# EAGLE design sbr (EAGLE 9.5.2)
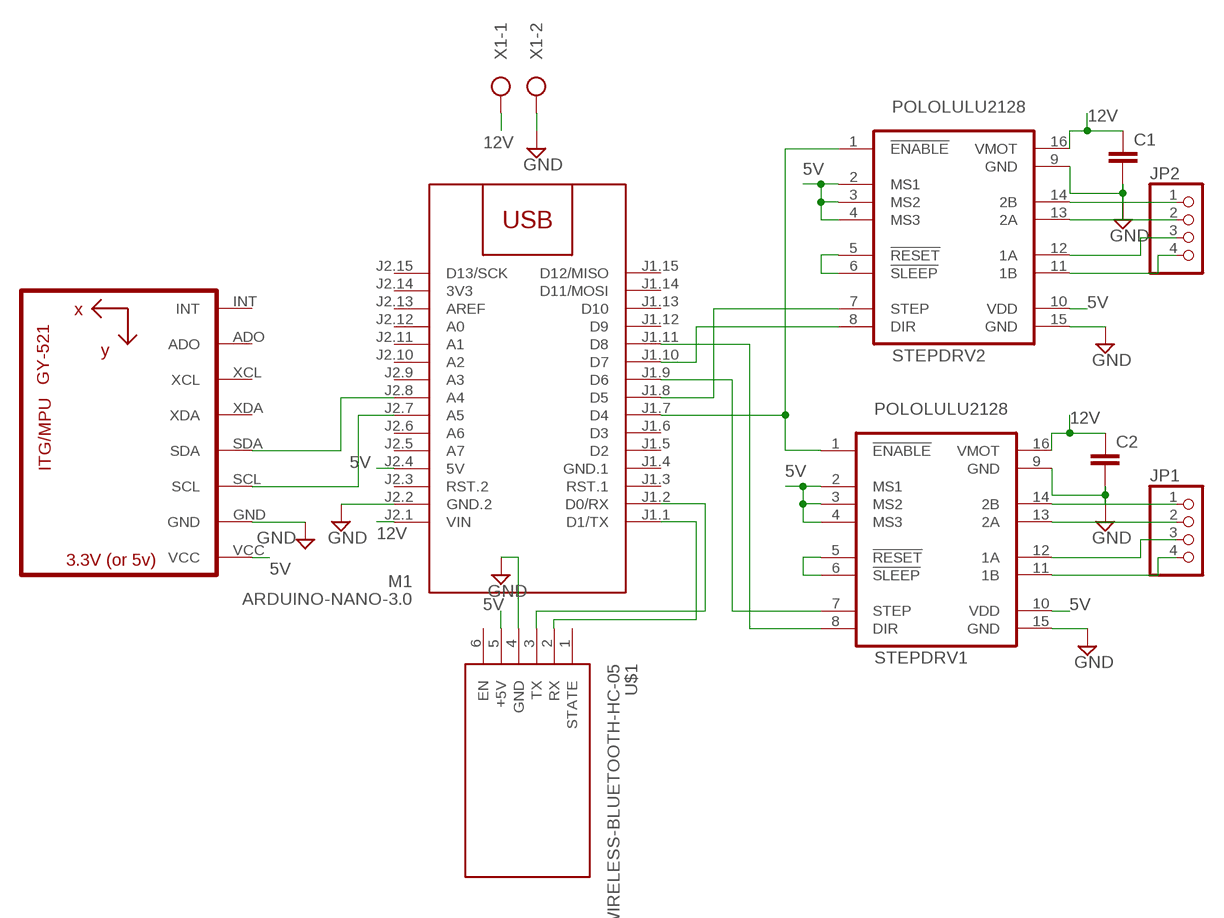
[diagram p0: schematic, sheet 1]

## Parts
C1  C-EU025-024X044  [C025-024X044]
C2  C-EU025-024X044  [C025-024X044]
JP1  PINHD-1X4  [1X04]
JP2  PINHD-1X4  [1X04]
M1  ARDUINO-NANO-3.0  [ARDUINO-NANO-3.0]
STEPDRV1  POLOLULU2128  [POLOLULU2128]
STEPDRV2  POLOLULU2128  [POLOLULU2128]
U1  GY-521MPU6050  [GY-521]
U$1  WIRELESS-BLUETOOTH-HC-05  [WIRELESS-BLUETOOTH-HC-05]
X1  W237-102  [W237-102]

## Nets
5V: M1.J2.4(5V) STEPDRV1.2(MS1) STEPDRV1.3(MS2) STEPDRV1.4(MS3) STEPDRV1.10(VDD) STEPDRV2.2(MS1) STEPDRV2.3(MS2) STEPDRV2.4(MS3) STEPDRV2.10(VDD) U1.VCC U$1.5(+5V)
12V: C1.1 C2.1 M1.J2.1(VIN) STEPDRV1.16(VMOT) STEPDRV2.16(VMOT) X1.1
GND: C1.2 C2.2 M1.J2.2(GND.2) STEPDRV1.9(GND) STEPDRV1.15(GND) STEPDRV2.9(GND) STEPDRV2.15(GND) U1.GND U$1.4(GND) X1.2
N$1: JP2.1 STEPDRV2.14(2B)
N$2: M1.J1.8(D5) STEPDRV2.7(STEP)
N$3: M1.J1.9(D6) STEPDRV1.7(STEP)
N$4: JP1.1 STEPDRV1.14(2B)
N$5: JP1.2 STEPDRV1.13(2A)
N$6: JP1.3 STEPDRV1.12(1A)
N$7: JP1.4 STEPDRV1.11(1B)
N$8: JP2.2 STEPDRV2.13(2A)
N$9: JP2.3 STEPDRV2.12(1A)
N$10: JP2.4 STEPDRV2.11(1B)
N$11: STEPDRV2.5(!RESET) STEPDRV2.6(!SLEEP)
N$12: STEPDRV1.5(!RESET) STEPDRV1.6(!SLEEP)
N$13: M1.J1.7(D4) STEPDRV1.1(!ENABLE) STEPDRV2.1(!ENABLE)
N$14: M1.J1.1(D1/TX) U$1.2(RX)
N$15: M1.J1.2(D0/RX) U$1.3(TX)
N$16: M1.J2.8(A4) U1.SDA
N$17: M1.J2.7(A5) U1.SCL
N$18: M1.J1.10(D7) STEPDRV2.8(DIR)
N$19: M1.J1.11(D8) STEPDRV1.8(DIR)
Unconnected: M1.J1.3(RST.1) M1.J1.5(D2) M1.J1.6(D3) M1.J1.12(D9) M1.J1.13(D10) M1.J1.14(D11/MOSI) M1.J1.15(D12/MISO) M1.J2.3(RST.2) M1.J2.5(A7) M1.J2.6(A6) M1.J2.9(A3) M1.J2.10(A2) M1.J2.11(A1) M1.J2.12(A0) M1.J2.13(AREF) M1.J2.15(D13/SCK) U1.ADO U1.INT U1.XCL U1.XDA U$1.1(STATE) U$1.6(EN)

## Power pins joined to a net without a drawn wire
3V3: M1.J2.14(3V3)
GND.1: M1.J1.4(GND.1)

## Library data of the parts
C1 C2 = rcl:C-EU: CAPACITOR, European symbol; SPICEPREFIX: C
JP1 JP2 = pinhead:PINHD-1X4: PIN HEADER
M1 = diy-modules:ARDUINO-NANO-3.0: Arduino Nano 3.0 and compatible devices More details available here: https://www.arduino.cc/en/Main/ArduinoBoardNano Click here to find device on ebay.com <http://www.ebay.com/sch/arduino+nano>
STEPDRV1 STEPDRV2 = stepper_drivers_etc:POLOLULU2128
U1 = gy-521:GY-521
U$1 = diy-modules:WIRELESS-BLUETOOTH-HC-05: Bluetooth Transceiver Module based on HC-05 board Tutorial is available here: https://arduino-info.wikispaces.com/BlueTooth-HC05-HC06-Modules-How-To Click here to find device on ebay.com <http://www.ebay.com/sch/hc-05+module+rs232>
X1 = con-wago-500:W237-102: WAGO SCREW CLAMP; MPN: 237-102; OC_FARNELL: unknown; OC_NEWARK: 70K9898

## Board
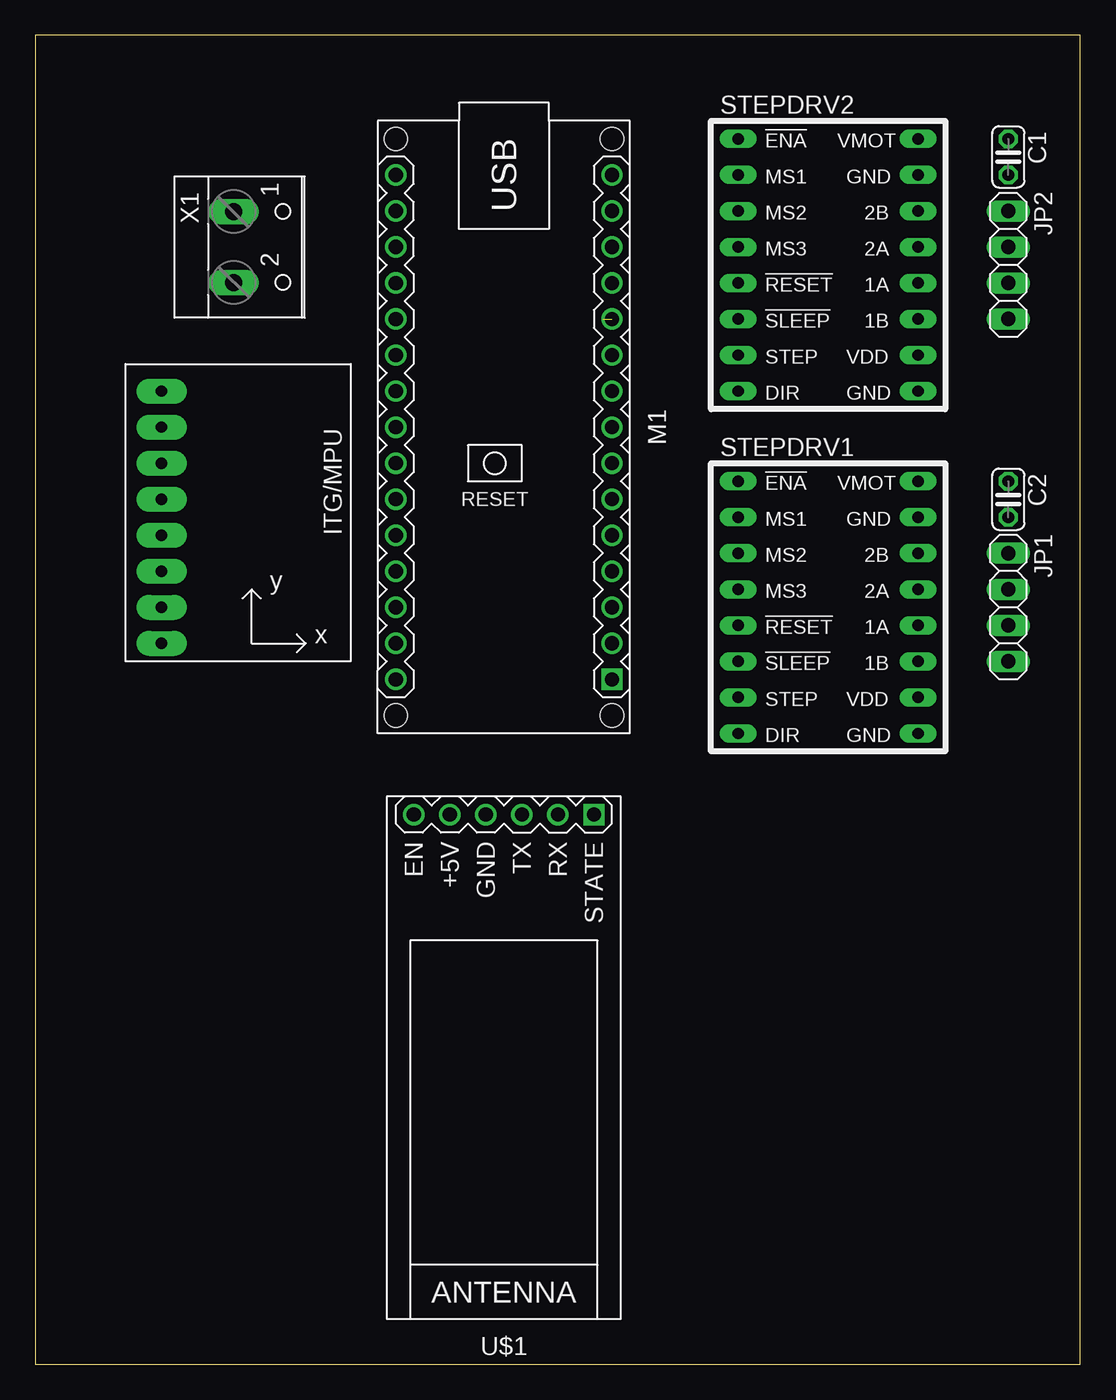
[diagram p1: board, top side]
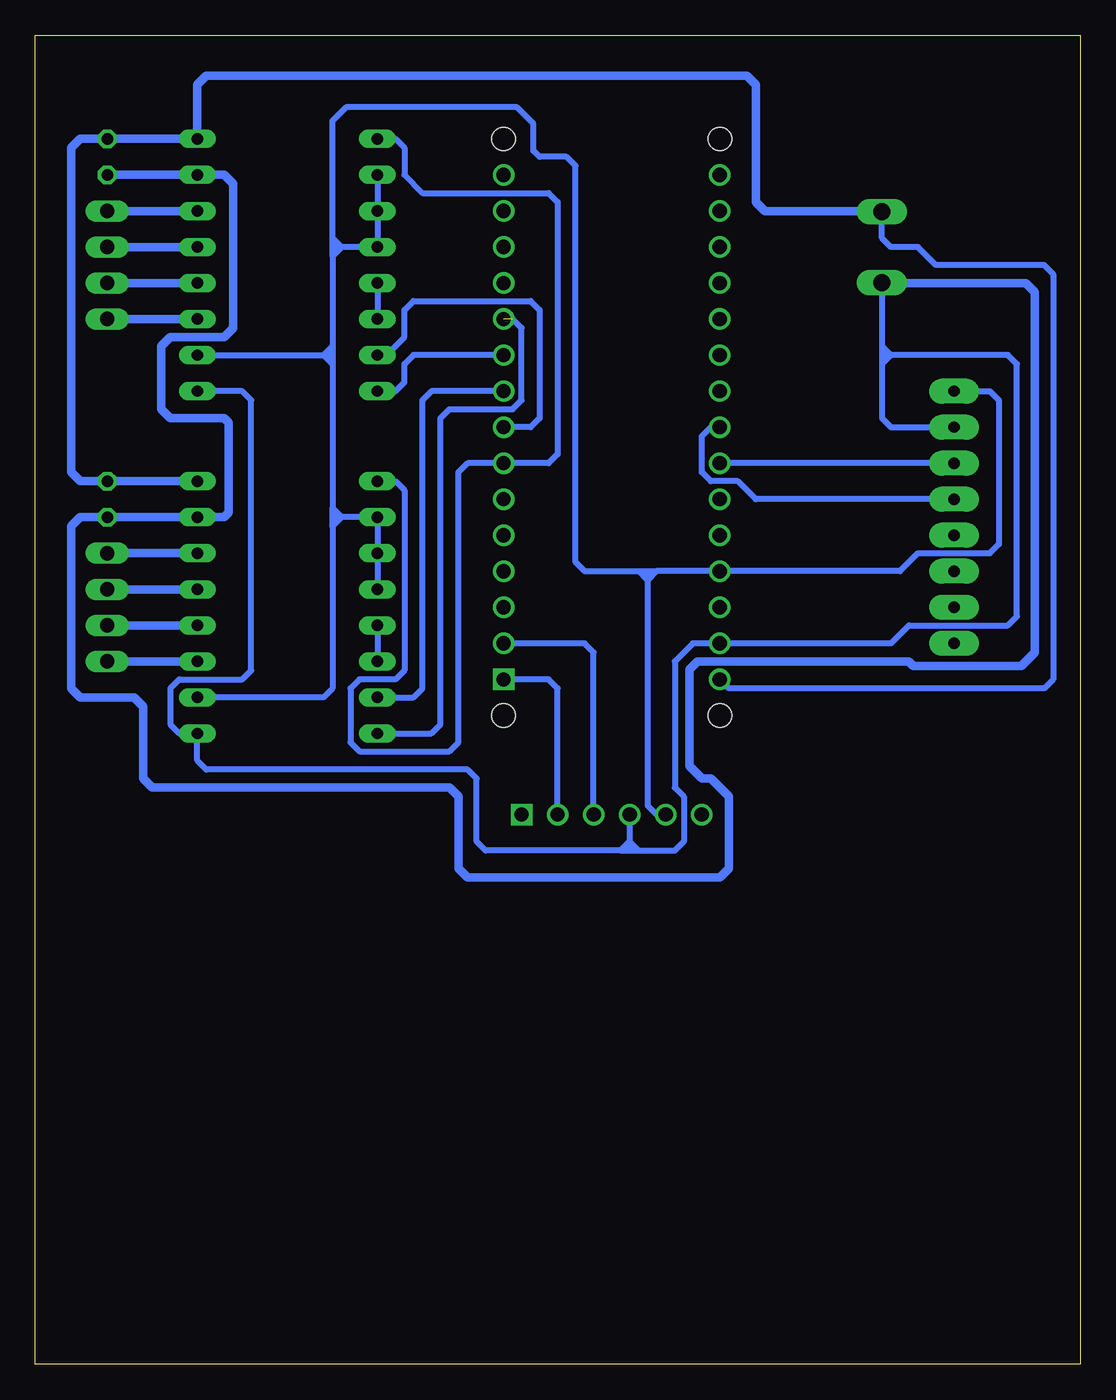
[diagram p2: board, bottom side, seen from below]

Size 73.64 x 93.65 mm. Coordinates in mm from the lower left corner, seen from the top.
Outline: 0,0 73.64,0 73.64,93.65 0,93.65 0,0
Copper layers (1*16): Top 0.035mm / dielectric 1.5mm / Bottom 0.035mm
Design rules "default": minimum track width 6mil, minimum drill 0.35mm, track to track 6mil, track to pad 6mil, pad to pad 6mil, via to via 6mil, smd to smd 6mil, copper to edge 40mil, drill to drill 6mil, minimum pad ring 10mil, minimum via ring 8mil, stop-mask expansion 4mil, vias tented up to drill 0mil, thermal gap 10mil

### Footprints (pad centres in the part's own frame; a part is rotated, then mirrored left to right if it is on the bottom)
C025-024X044 = drill 0.813 octagon: 1 -1.27,0; 2 1.27,0
1X04 = drill 1.016 long: 1 -3.81,0; 2 -1.27,0; 3 1.27,0; 4 3.81,0
ARDUINO-NANO-3.0 = drill 1 square: J1.1 17.78,7.62 | drill 1: J1.2 15.24,7.62; J1.3 12.7,7.62; J1.4 10.16,7.62; J1.5 7.62,7.62; J1.6 5.08,7.62; J1.7 2.54,7.62; J1.8 0,7.62; J1.9 -2.54,7.62; J1.10 -5.08,7.62; J1.11 -7.62,7.62; J1.12 -10.16,7.62; J1.13 -12.7,7.62; J1.14 -15.24,7.62; J1.15 -17.78,7.62; J2.1 17.78,-7.62; J2.2 15.24,-7.62; J2.3 12.7,-7.62; J2.4 10.16,-7.62; J2.5 7.62,-7.62; J2.6 5.08,-7.62; J2.7 2.54,-7.62; J2.8 0,-7.62; J2.9 -2.54,-7.62; J2.10 -5.08,-7.62; J2.11 -7.62,-7.62; J2.12 -10.16,-7.62; J2.13 -12.7,-7.62; J2.14 -15.24,-7.62; J2.15 -17.78,-7.62 | hole 1.651: -20.32,7.62; -20.32,-7.62; 20.32,-7.62; 20.32,7.62
POLOLULU2128 = drill 0.8 long: 1 -7.62,7.62; 2 -7.62,5.08; 3 -7.62,2.54; 4 -7.62,0; 5 -7.62,-2.54; 6 -7.62,-5.08; 7 -7.62,-7.62; 8 -7.62,-10.16; 9 5.08,-10.16; 10 5.08,-7.62; 11 5.08,-5.08; 12 5.08,-2.54; 13 5.08,0; 14 5.08,2.54; 15 5.08,5.08; 16 5.08,7.62
GY-521 = drill 0.8 pad 1.778 long: ADO -8.89,-6.35; GND -8.89,6.35; INT -8.89,-8.89; SCL -8.89,3.81; SDA -8.89,1.27; VCC -8.89,8.89; XCL -8.89,-3.81; XDA -8.89,-1.27
WIRELESS-BLUETOOTH-HC-05 = drill 1 square: 1 -6.35,-17.145 | drill 1: 2 -3.81,-17.145; 3 -1.27,-17.145; 4 1.27,-17.145; 5 3.81,-17.145; 6 6.35,-17.145
W237-102 = drill 1.194 long: 1 -2.5,-1.27; 2 2.5,-1.27

### Placement (x,y rotation side)
C1  68.58,85.09 270 top
C2  68.58,60.96 270 top
JP1  68.58,53.34 270 top
JP2  68.58,77.47 270 top
M1  33.02,66.04 270 top
STEPDRV1  57.15,54.61 0 top
STEPDRV2  57.15,78.74 0 top
U1  17.78,59.69 0 top
U$1  33.02,21.59 180 top
X1  15.24,78.74 270 top

### Tracks (layer width: path | path; a pad name or v marks a point on that pad's centre or on a via)
5V
  Bottom 0.406: STEPDRV2.2 STEPDRV2.3 STEPDRV2.4 | STEPDRV1.4 STEPDRV1.3 STEPDRV1.2 52.07,59.69 | STEPDRV2.4 50.8,78.74 | U1.VCC 6.35,68.58 5.71,67.94 5.71,57.79 6.35,57.15 11.43,57.15 12.7,55.88 M1.J2.4 29.84,55.88 | 52.07,78.74 52.7,78.1 | 52.7,78.1 52.7,71.75 | 52.7,71.75 52.7,71.12 | 52.7,71.12 52.7,70.48 | 52.7,70.48 52.7,60.33 | 52.7,60.33 52.07,59.69 | STEPDRV2.4 52.07,78.74 | STEPDRV2.10 53.34,71.12 | 53.34,71.12 52.7,71.12 | 53.34,71.12 52.7,71.75 | 52.7,70.48 53.34,71.12 | 52.7,59.05 52.7,59.69 | 52.7,59.69 52.7,60.33 | 52.07,59.69 52.7,59.05 | 52.07,59.69 52.7,59.69 | 52.7,59.05 52.7,47.62 53.34,46.99 STEPDRV1.10 | 30.48,55.88 29.84,55.88 | 52.7,78.1 52.7,78.74 | 52.7,78.74 52.7,79.38 | 52.7,79.38 52.7,87.63 51.75,88.58 39.69,88.58 38.53,87.43 38.53,85.52 38.1,85.09 36.19,85.09 35.56,84.45 35.56,56.52 34.92,55.88 31.11,55.88 | 31.11,55.88 30.48,55.88 | 52.07,78.74 52.7,79.38 | 52.07,78.74 52.7,78.74 | U$1.5 29.84,38.74 30.48,39.37 30.48,55.25 | 30.48,55.88 30.48,55.25 | 30.48,55.25 31.11,55.88 | 30.48,55.25 29.84,55.88
12V
  Bottom 0.406: X1.1 13.97,79.38 13.34,78.74 11.43,78.74 10.16,77.47 2.54,77.47 1.91,76.83 1.91,48.26 2.54,47.62 24.77,47.62 M1.J2.1
  Bottom 0.61: X1.1 14.01,81.28 22.22,81.28 22.86,81.91 22.86,90.17 23.49,90.8 61.59,90.8 62.23,90.17 STEPDRV2.16 C1.1 70.48,86.36 71.12,85.72 71.12,62.87 70.48,62.23 C2.1 STEPDRV1.16
GND
  Bottom 0.406: X1.2 13.97,76.2 13.97,71.75 | 13.97,71.75 13.97,71.12 | 13.97,71.12 13.97,70.48 | 13.97,70.48 13.97,66.67 13.34,66.04 U1.GND | U$1.4 31.75,36.83 | 31.75,36.83 32.38,36.2 | 32.38,36.2 31.75,36.2 | 31.75,36.2 31.11,36.2 | 31.11,36.2 28.58,36.2 27.94,36.83 27.94,40.01 28.58,40.64 28.58,49.53 27.3,50.8 M1.J2.2 13.34,50.8 12.06,52.07 5.08,52.07 4.45,52.71 4.45,70.48 5.08,71.12 13.34,71.12 | 31.75,36.2 31.75,36.83 | 31.11,36.2 31.75,36.83 | 13.97,71.12 13.34,71.12 | 13.34,71.12 13.97,71.75 | 13.34,71.12 13.97,70.48 | 32.38,36.2 41.91,36.2 42.55,36.83 42.55,41.28 43.18,41.91 61.59,41.91 62.23,42.55 STEPDRV1.9 63.5,44.45 64.13,45.09 64.13,47.62 63.5,48.26 59.05,48.26 58.42,48.9 58.42,67.94 59.05,68.58 STEPDRV2.9
  Bottom 0.61: C1.2 STEPDRV2.15 60.33,83.82 59.69,83.19 59.69,73.02 60.33,72.39 64.13,72.39 64.77,71.75 64.77,67.31 64.13,66.67 60.33,66.67 60.01,66.36 60.01,60.01 60.33,59.69 STEPDRV1.15 C2.2 70.48,59.69 71.12,59.05 71.12,47.62 70.48,46.99 66.67,46.99 66.04,46.36 66.04,41.28 65.41,40.64 44.45,40.64 43.81,40.01 43.81,34.93 43.18,34.29 25.4,34.29 24.77,34.93 24.77,40.01 26.03,41.28 26.67,41.28 27.55,42.15 27.55,48.97 26.99,49.53 12.06,49.53 11.75,49.21 4.13,49.21 3.17,50.17 3.17,75.56 3.81,76.2 13.97,76.2
N$1
  Bottom 0.61: STEPDRV2.14 JP2.1
N$2
  Bottom 0.406: STEPDRV2.7 48.89,71.12 47.62,72.39 47.62,74.3 46.99,74.93 38.73,74.93 38.1,74.3 38.1,66.67 38.73,66.04 M1.J1.8
N$3
  Bottom 0.406: 48.26,46.99 STEPDRV1.7 46.99,46.99 46.36,47.62 46.36,67.94 45.72,68.58 M1.J1.9
N$4
  Bottom 0.61: STEPDRV1.14 JP1.1
N$5
  Bottom 0.61: STEPDRV1.13 JP1.2
N$6
  Bottom 0.61: STEPDRV1.12 JP1.3
N$7
  Bottom 0.61: STEPDRV1.11 JP1.4
N$8
  Bottom 0.61: STEPDRV2.13 JP2.2
N$9
  Bottom 0.61: STEPDRV2.12 JP2.3
N$10
  Bottom 0.61: STEPDRV2.11 JP2.4
N$11
  Bottom 0.406: STEPDRV2.5 STEPDRV2.6
N$12
  Bottom 0.406: STEPDRV1.5 STEPDRV1.6
N$13
  Bottom 0.406: STEPDRV2.1 48.26,86.36 47.62,85.72 47.62,83.82 46.36,82.55 37.47,82.55 36.83,81.91 36.83,64.14 37.47,63.5 M1.J1.7 43.18,63.5 43.81,62.87 43.81,43.82 44.45,43.18 50.8,43.18 51.44,43.82 51.44,47.62 50.8,48.26 48.26,48.26 47.62,48.9 47.62,61.6 48.26,62.23 STEPDRV1.1
N$14
  Bottom 0.406: U$1.2 36.83,47.62 37.47,48.26 M1.J1.1
N$15
  Bottom 0.406: U$1.3 34.29,50.17 34.92,50.8 M1.J1.2
N$16
  Bottom 0.406: U1.SDA 22.86,60.96 24.13,62.23 26.03,62.23 26.67,62.87 26.67,65.41 26.03,66.04 M1.J2.8
N$17
  Bottom 0.406: U1.SCL M1.J2.7
N$18
  Bottom 0.406: STEPDRV2.8 48.26,68.58 47.62,69.21 47.62,70.48 46.99,71.12 M1.J1.10
N$19  (1 unrouted)
  Bottom 0.406: 40,73.66 39.37,73.02 39.37,67.94 40,67.31 44.45,67.31 45.08,66.67 45.08,45.09 45.72,44.45 STEPDRV1.8